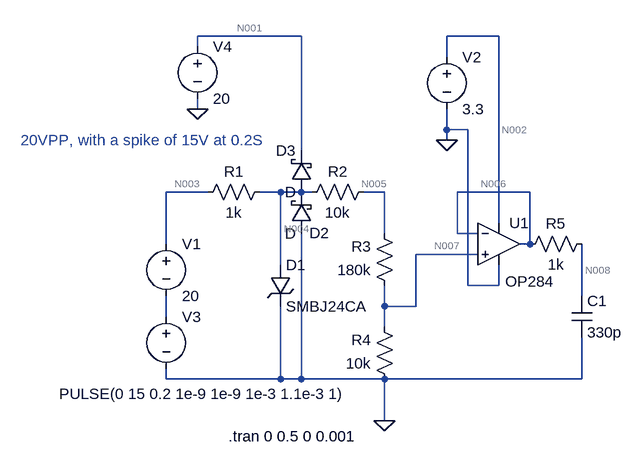
[diagram p0: schematic Precondition.asc]
Precondition.asc, the LTspice schematic file:
Version 4.1
SHEET 1 1192 680
WIRE 240 -192 80 -192
WIRE 544 -192 464 -192
WIRE 80 -176 80 -192
WIRE 464 -160 464 -192
WIRE 80 -80 80 -96
WIRE 464 -48 464 -80
WIRE 496 -48 464 -48
WIRE 464 -32 464 -48
WIRE 240 -16 240 -192
WIRE 96 48 32 48
WIRE 208 48 176 48
WIRE 240 48 208 48
WIRE 256 48 240 48
WIRE 368 48 336 48
WIRE 592 48 480 48
WIRE 544 96 544 -192
WIRE 368 112 368 48
WIRE 480 112 480 48
WIRE 512 112 480 112
WIRE 32 128 32 48
WIRE 592 128 592 48
WIRE 592 128 576 128
WIRE 512 144 416 144
WIRE 208 160 208 48
WIRE 496 192 496 -48
WIRE 544 192 544 160
WIRE 544 192 496 192
WIRE 672 208 672 128
WIRE 368 224 368 192
WIRE 416 224 416 144
WIRE 416 224 368 224
WIRE 32 240 32 208
WIRE 368 256 368 224
WIRE 32 336 32 320
WIRE 208 336 208 224
WIRE 208 336 32 336
WIRE 240 336 240 112
WIRE 240 336 208 336
WIRE 368 336 240 336
WIRE 672 336 672 272
WIRE 672 336 368 336
WIRE 368 400 368 336
FLAG 464 -32 0
FLAG 368 400 0
FLAG 80 -80 0
SYMBOL voltage 32 112 R0
WINDOW 123 0 0 Left 0
WINDOW 39 0 0 Left 0
SYMATTR InstName V1
SYMATTR Value 20
SYMBOL res 192 32 R90
WINDOW 0 0 56 VBottom 2
WINDOW 3 32 56 VTop 2
SYMATTR InstName R1
SYMATTR Value 1k
SYMBOL res 352 32 R90
WINDOW 0 0 56 VBottom 2
WINDOW 3 32 56 VTop 2
SYMATTR InstName R2
SYMATTR Value 10k
SYMBOL res 384 208 R180
WINDOW 0 36 76 Left 2
WINDOW 3 36 40 Left 2
SYMATTR InstName R3
SYMATTR Value 180k
SYMBOL res 384 352 R180
WINDOW 0 36 76 Left 2
WINDOW 3 36 40 Left 2
SYMATTR InstName R4
SYMATTR Value 10k
SYMBOL cap 656 208 R0
SYMATTR InstName C1
SYMATTR Value 330p
SYMBOL res 688 112 R90
WINDOW 0 0 56 VBottom 2
WINDOW 3 32 56 VTop 2
SYMATTR InstName R5
SYMATTR Value 1k
SYMBOL voltage 464 -176 R0
WINDOW 123 0 0 Left 0
WINDOW 39 0 0 Left 0
SYMATTR InstName V2
SYMATTR Value 3.3
SYMBOL OpAmps\\OP284 544 64 R0
WINDOW 3 10 122 Left 2
SYMATTR InstName U1
SYMBOL TVSdiode 192 160 R0
SYMATTR InstName D1
SYMATTR Value SMBJ24CA
SYMBOL voltage 32 224 R0
WINDOW 123 0 0 Left 0
WINDOW 39 0 0 Left 0
WINDOW 3 -165 135 Left 2
SYMATTR Value PULSE(0 15 0.2 1e-9 1e-9 1e-3 1.1e-3 1)
SYMATTR InstName V3
SYMBOL schottky 256 112 R180
WINDOW 0 -27 1 Left 2
WINDOW 3 24 0 Left 2
SYMATTR InstName D2
SYMBOL schottky 256 48 R180
WINDOW 0 24 64 Left 2
WINDOW 3 24 0 Left 2
SYMATTR InstName D3
SYMBOL voltage 80 -192 R0
WINDOW 123 0 0 Left 0
WINDOW 39 0 0 Left 0
SYMATTR InstName V4
SYMATTR Value 20
TEXT 128 424 Left 2 !.tran 0 0.5 0 0.001
TEXT -192 -32 Left 2 ;20VPP, with a spike of 15V at 0.2S

The netlist it stands for:
* Precondition.asc
V1 N003 N009 20
R1 N004 N003 1k
R2 N005 N004 10k
R3 N007 N005 180k
R4 0 N007 10k
C1 N008 0 330p
R5 N008 N006 1k
V2 N002 0 3.3
X§U1 N007 N006 N002 0 N006 OP284  ; pins In+ In- V+ V- OUT
D1 N004 0 SMBJ24CA
V3 N009 0 PULSE(0 15 0.2 1e-9 1e-9 1e-3 1.1e-3 1)
D2 0 N004 D
D3 N004 N001 D
V4 N001 0 20
.model D D
.lib standard.dio
.tran 0 0.5 0 0.001
* 20VPP, with a spike of 15V at 0.2S
.lib ADI1.lib
.backanno
.end

* Results of the author's LTspice run, read from the files saved beside the schematic
* Operating Point, zero values left out:
*   V(n001) = 20 V
*   V(n002) = 3.3 V
*   V(n003) = 20 V
*   V(n004) = 19.9 V
*   V(n005) = 18.91 V
*   V(n006) = 996 mV
*   V(n007) = 995.6 mV
*   V(n008) = 996 mV
*   I(D1) = 398 nA
*   I(D2) = -19.91 pA
*   I(R1) = -99.9 µA
*   I(R2) = -99.5 µA
*   I(R3) = -99.5 µA
*   I(R4) = -99.56 µA
*   I(V1) = -99.9 µA
*   I(V2) = -812.2 µA
*   I(V3) = -99.9 µA
*   Ix(u1:1) = -58.03 nA
*   Ix(u1:2) = -126.3 nA
*   Ix(u1:3) = 812.2 µA
*   Ix(u1:4) = -812.2 µA
*   Ix(u1:5) = 126.3 nA
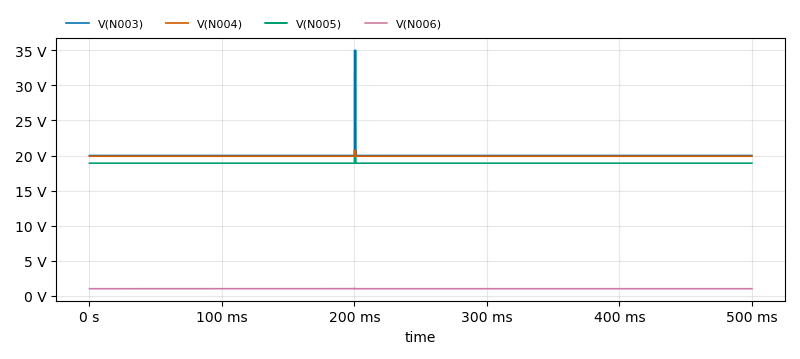
[diagram p1: Transient Analysis of Precondition.asc, plotted from the saved traces]
* Transient Analysis, 1 run:
*   V(N003): min 20 V, max 35 V, average 20.03 V, rms 20.04 V, last 20 V
*   V(N004): min 19.9 V, max 20.72 V, average 19.9 V, rms 19.9 V, last 19.9 V
*   V(N005): min 18.91 V, max 19.69 V, average 18.91 V, rms 18.91 V, last 18.91 V
*   V(N006): min 984.5 mV, max 1.049 V, average 996.1 mV, rms 996.1 mV, last 996 mV